# EAGLE schematic TestBoardRevB (EAGLE 7.5.0)
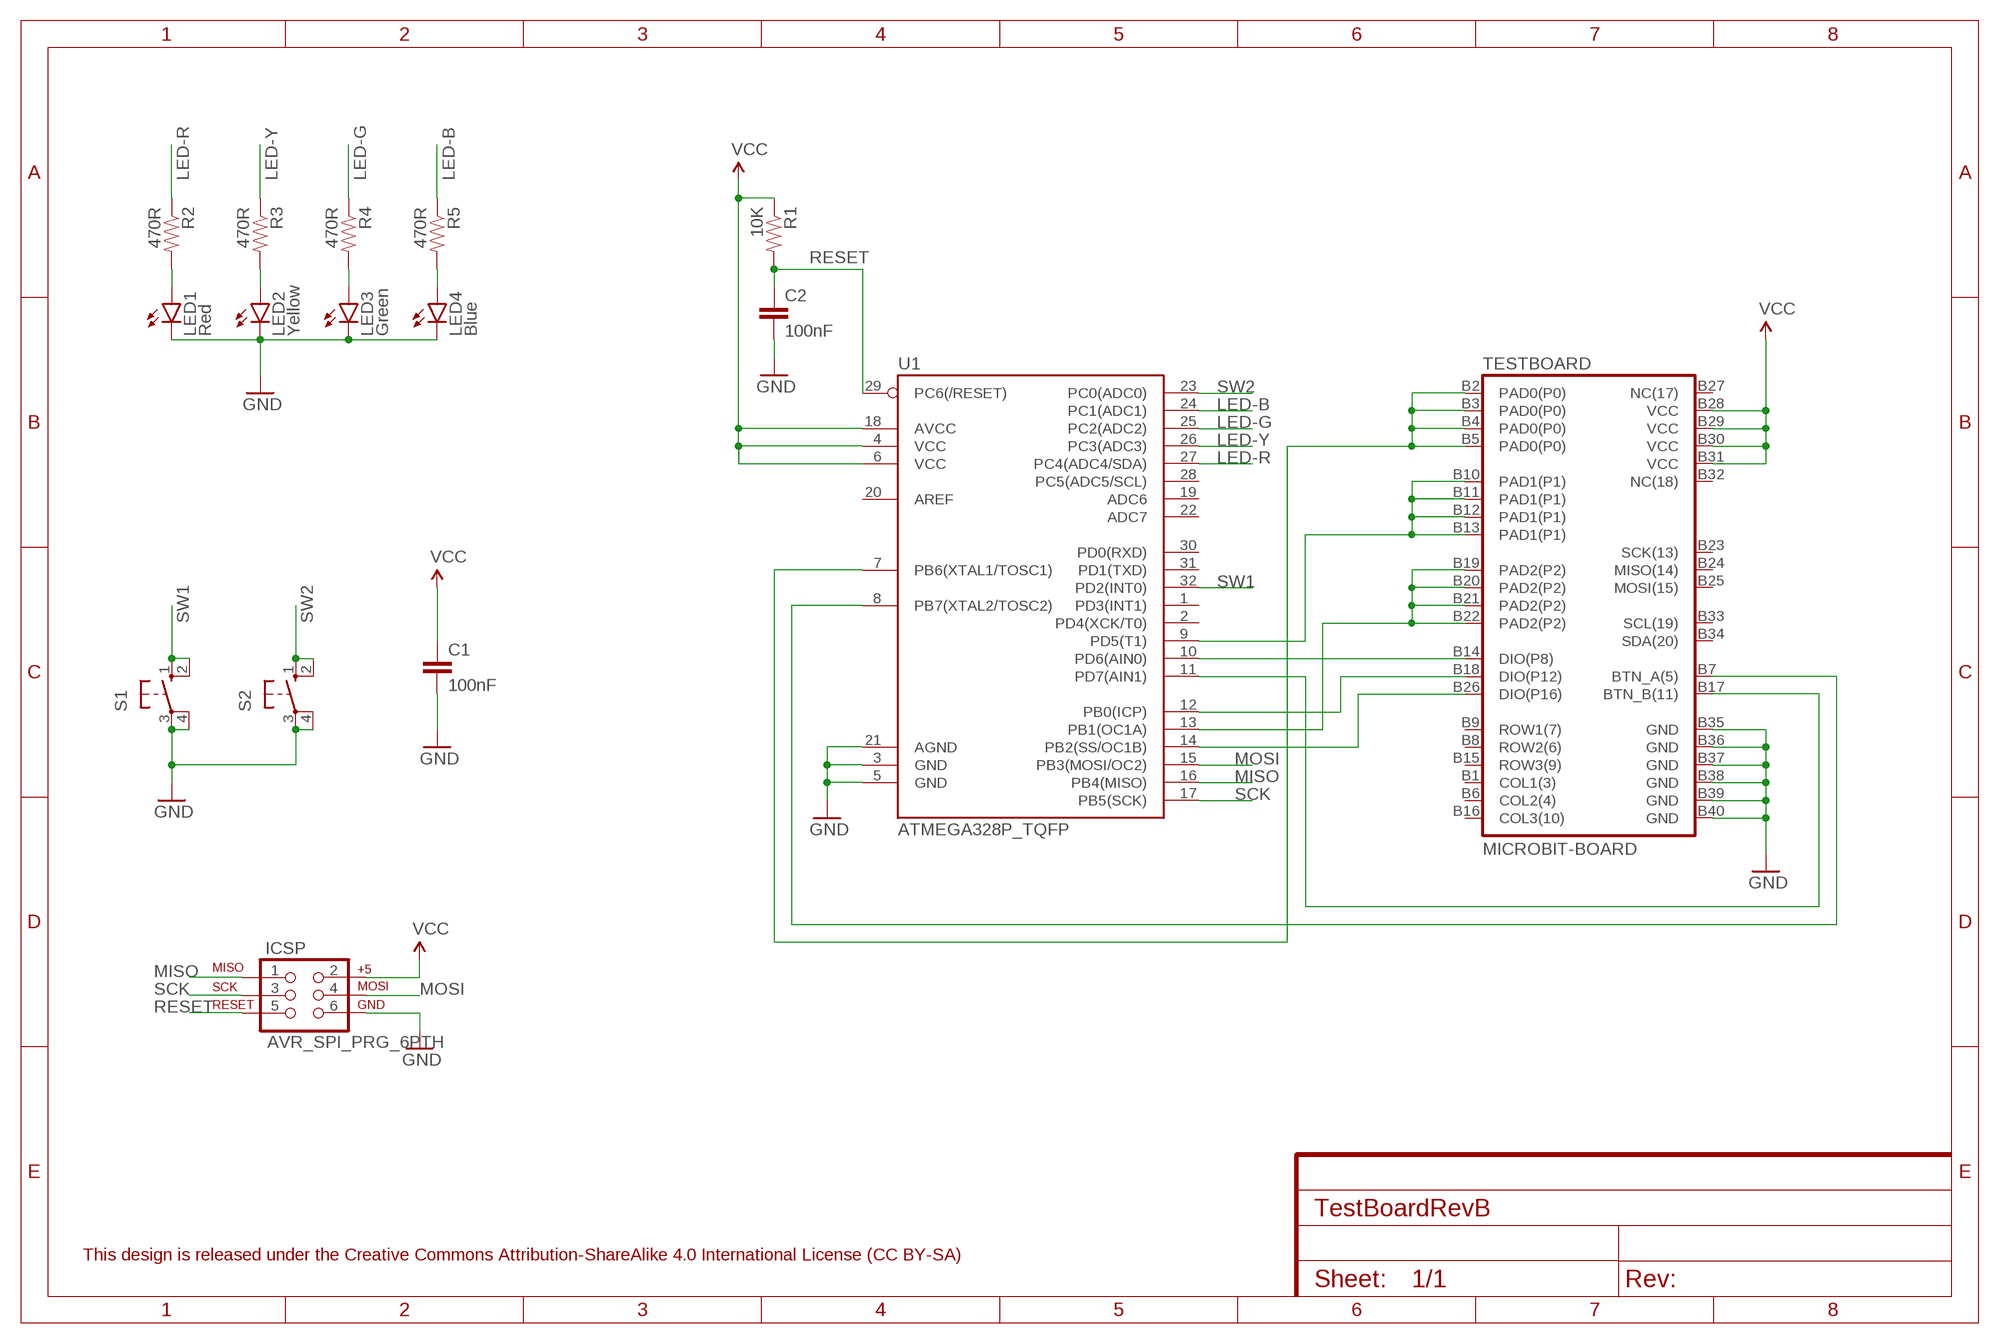
[diagram p0: schematic, sheet 1]
FRAME1 (FRAME-A4L): CNAME: MicroBit Test Board; CREVISION: B 03/2016; DESIGNER: A J Instone-Cowie

## Parts
C1  100nF  CAP0603-CAP  [0603-CAP]
C2  100nF  CAP0603-CAP  [0603-CAP]
ICSP  AVR_SPI_PRG_6PTH  [2X3]
LED1  Red  LED0603  [LED-0603]
LED2  Yellow  LED0603  [LED-0603]
LED3  Green  LED0603  [LED-0603]
LED4  Blue  LED0603  [LED-0603]
R1  10K  RESISTOR0603-RES  [0603-RES]
R2  470R  RESISTOR0603-RES  [0603-RES]
R3  470R  RESISTOR0603-RES  [0603-RES]
R4  470R  RESISTOR0603-RES  [0603-RES]
R5  470R  RESISTOR0603-RES  [0603-RES]
S1  10-XX  [B3F-10XX]
S2  10-XX  [B3F-10XX]
TESTBOARD  MICROBIT-BOARD  [MICROBIT-EDGE-CONN]
U1  ATMEGA328P_TQFP  [TQFP32-08]

## Nets
GND: C1.2 C2.2 ICSP.6 LED1.C LED2.C LED3.C LED4.C S1.3(P) S1.4(P1) S2.3(P) S2.4(P1) TESTBOARD.B35(GND) TESTBOARD.B36(GND) TESTBOARD.B37(GND) TESTBOARD.B38(GND) TESTBOARD.B39(GND) TESTBOARD.B40(GND) U1.3(GND) U1.5(GND) U1.21(AGND)
LED-B: R5.1 U1.24(PC1(ADC1))
LED-G: R4.1 U1.25(PC2(ADC2))
LED-R: R2.1 U1.27(PC4(ADC4/SDA))
LED-Y: R3.1 U1.26(PC3(ADC3))
MISO: ICSP.1 U1.16(PB4(MISO))
MOSI: ICSP.4 U1.15(PB3(MOSI/OC2))
N$1: LED3.A R4.2
N$2: TESTBOARD.B2(PAD0(P0)) TESTBOARD.B3(PAD0(P0)) TESTBOARD.B4(PAD0(P0)) TESTBOARD.B5(PAD0(P0)) U1.7(PB6(XTAL1/TOSC1))
N$3: TESTBOARD.B7(BTN_A(5)) U1.8(PB7(XTAL2/TOSC2))
N$4: TESTBOARD.B19(PAD2(P2)) TESTBOARD.B20(PAD2(P2)) TESTBOARD.B21(PAD2(P2)) TESTBOARD.B22(PAD2(P2)) U1.13(PB1(OC1A))
N$5: LED4.A R5.2
N$6: TESTBOARD.B10(PAD1(P1)) TESTBOARD.B11(PAD1(P1)) TESTBOARD.B12(PAD1(P1)) TESTBOARD.B13(PAD1(P1)) U1.9(PD5(T1))
N$8: LED1.A R2.2
N$10: TESTBOARD.B14(DIO(P8)) U1.10(PD6(AIN0))
N$11: TESTBOARD.B18(DIO(P12)) U1.12(PB0(ICP))
N$12: TESTBOARD.B26(DIO(P16)) U1.14(PB2(SS/OC1B))
N$13: TESTBOARD.B17(BTN_B(11)) U1.11(PD7(AIN1))
N$16: LED2.A R3.2
RESET: C2.1 ICSP.5 R1.2 U1.29(PC6(/RESET))
SCK: ICSP.3 U1.17(PB5(SCK))
SW1: S1.1(S) S1.2(S1) U1.32(PD2(INT0))
SW2: S2.1(S) S2.2(S1) U1.23(PC0(ADC0))
VCC: C1.1 ICSP.2 R1.1 TESTBOARD.B28(VCC) TESTBOARD.B29(VCC) TESTBOARD.B30(VCC) TESTBOARD.B31(VCC) U1.4(VCC) U1.6(VCC) U1.18(AVCC)
Unconnected: TESTBOARD.B1(COL1(3)) TESTBOARD.B6(COL2(4)) TESTBOARD.B8(ROW2(6)) TESTBOARD.B9(ROW1(7)) TESTBOARD.B15(ROW3(9)) TESTBOARD.B16(COL3(10)) TESTBOARD.B23(SCK(13)) TESTBOARD.B24(MISO(14)) TESTBOARD.B25(MOSI(15)) TESTBOARD.B27(NC(17)) TESTBOARD.B32(NC(18)) TESTBOARD.B33(SCL(19)) TESTBOARD.B34(SDA(20)) U1.1(PD3(INT1)) U1.2(PD4(XCK/T0)) U1.19(ADC6) U1.20(AREF) U1.22(ADC7) U1.28(PC5(ADC5/SCL)) U1.30(PD0(RXD)) U1.31(PD1(TXD))

## Notes on the sheet
- This design is released under the Creative Commons Attribution-ShareAlike 4.0 International License (CC BY-SA)

## Library data of the parts
C1 C2 = SparkFun-Capacitors:CAP: Capacitor Standard 0603 ceramic capacitor, and 0.1" leaded capacitor.
ICSP = SparkFun-Connectors:AVR_SPI_PRG_6: AVR ISP 6 Pin This is the reduced ISP connector for AVR programming. Common on Arduino. This footprint will take up less PCB space and can be used with a 10-pin to 6-pin adapter such as SKU: BOB-08508 **Special note about "TEST_POINT" package. The stop mask is on the top side, so if you want your programming test points to be on the bottom of your board, make sure to place this package on the bottom side of the board. This also ensure that the orientation to program from the bottom side will be correct.
LED1-LED4 = SparkFun-LED:LED: LEDs Standard schematic elements and footprints for 5mm, 3mm, 1206, and 0603 sized LEDs. 5mm - Spark Fun Electronics SKU : COM-00529 (and others)
R1-R5 = SparkFun-Passives:RESISTOR: Resistor Basic schematic elements and footprints for 0603, 1206, and PTH resistors.
S1 S2 = switch-omron:10-XX: OMRON SWITCH; MPN: B3F-1000; OC_FARNELL: 176432; OC_NEWARK: 36M3542
TESTBOARD = MicroBit_Custom:MICROBIT-: Updated for first production Micro:Bit release (with Button A on Pin 5). See https://www.microbit.co.uk/device/pins Pins 17 & 18 not connected to VCC as a protection against mis-insertion of the Micro:Bit into the edge connector.
U1 = SparkFun-DigitalIC:ATMEGA328P_TQFP; PROD_ID: IC-09069